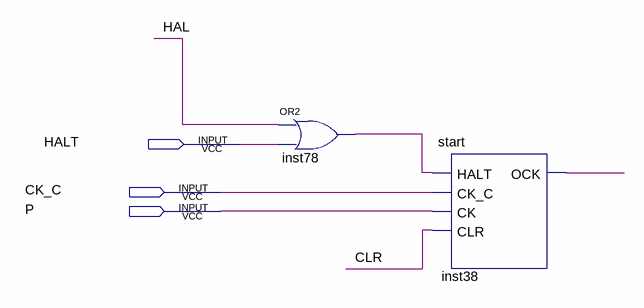
[diagram p0: schematic sheet]
// Quartus schematic temp0.bdf as structural Verilog: 2 symbols, 3 pins
module temp0 (
  input  HALT,
  input  CK_C,
  input  P
);

  wire CLR, HAL, inst38_ock, inst78_out;

  or inst78 (inst78_out, HAL, HALT);
  start inst38 (.HALT(inst78_out), .CK_C(CK_C), .CK(P), .CLR(CLR), .OCK(inst38_ock));
endmodule
